# Altium schematic sheet 3-PWR_BAK_BATT.SCHDOC
size A4
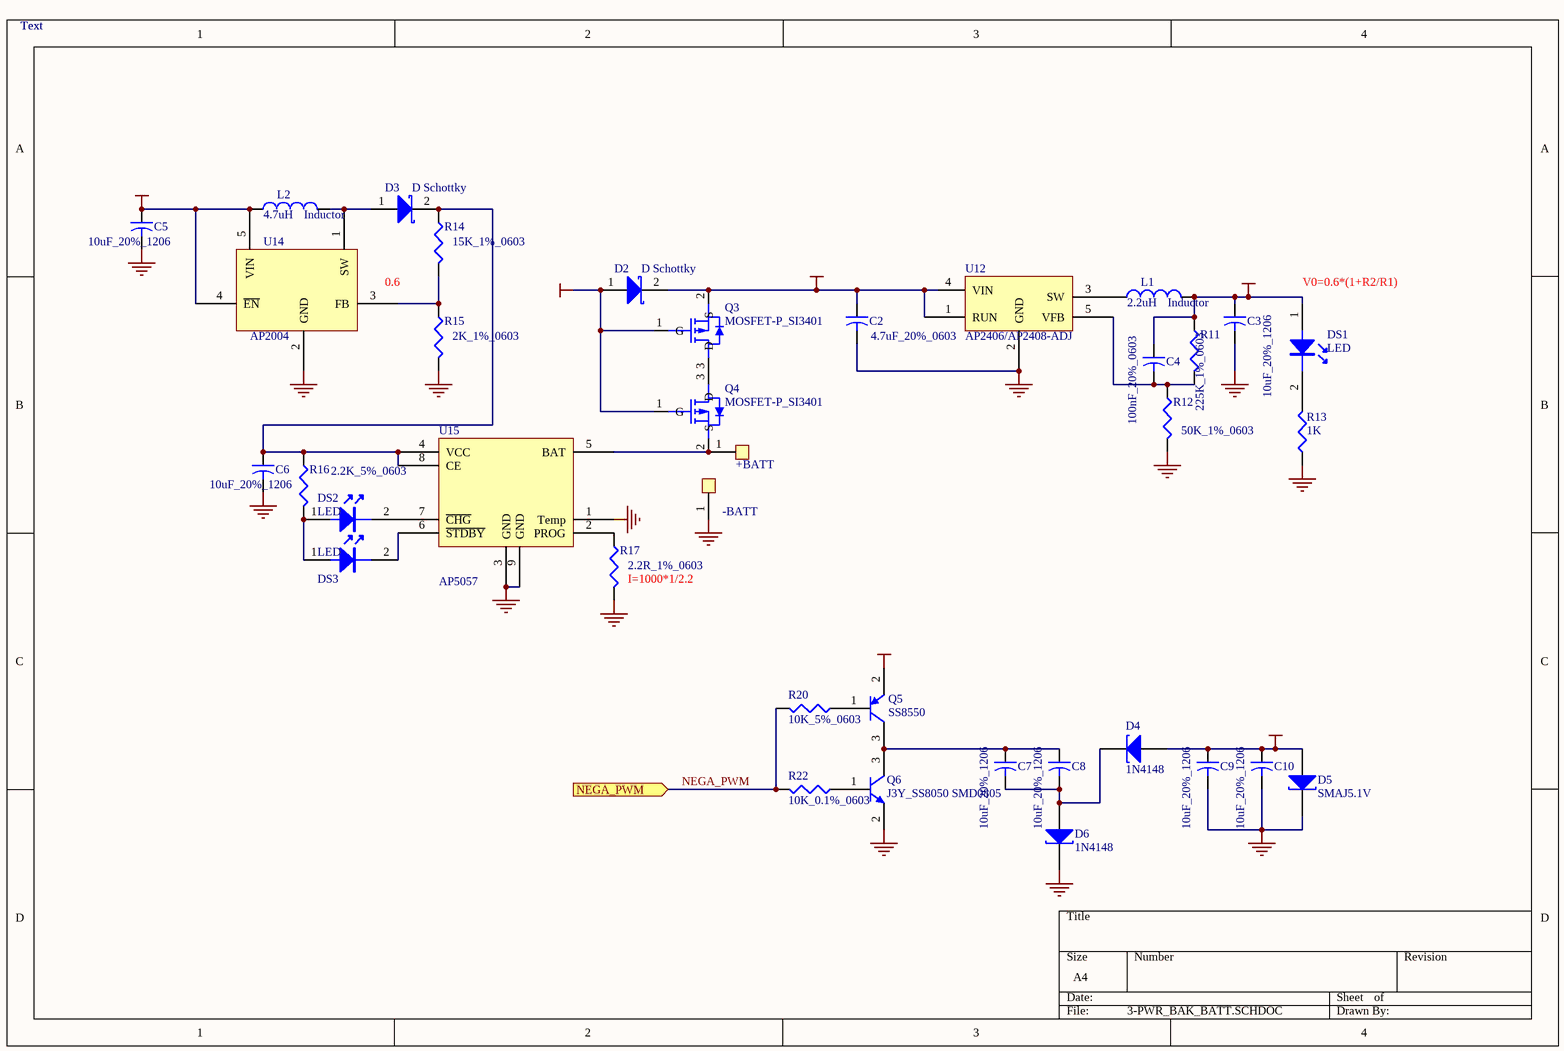
[diagram p0: 3-PWR_BAK_BATT.SCHDOC]

## Parts
+BATT  ND  [END_1.5_2.2]  (value not drawn)
-BATT  ND  [END_1.5_2.2]  (value not drawn)
C2  4.7uF_20%_0603  [C1608-0603]
C3  10uF_20%_1206  [CC3216-1206]
C4  100nF_20%_0603  [C1608-0603]
C5  10uF_20%_1206  [CC3216-1206]
C6  10uF_20%_1206  [CC3216-1206]
C7  10uF_20%_1206  [CC3216-1206]
C8  10uF_20%_1206  [CC3216-1206]
C9  10uF_20%_1206  [CC3216-1206]
C10  10uF_20%_1206  [CC3216-1206]
D2  D Schottky  [DO-214AA_785X100_200X160A100L_P]
D3  D Schottky  [DO-M7]
D4  1N4148  [DSO-F2/D6.1]
D5  SMAJ5.1V  [DSO-F2/D6.1]
D6  1N4148  [DSO-F2/D6.1]
DS1  LED  [LED0805]
DS2  LED  [LED0805]
DS3  LED  [LED0805]
L1  Inductor  value 2.2uH  [L6x6x3_3A]
L2  Inductor  value 4.7uH  [L6x6x3_3A]
Q3  MOSFET-P_SI3401  [SO-G3/C2.5]
Q4  MOSFET-P_SI3401  [SO-G3/C2.5]
Q5  SS8550  [SO-G3/C2.5]
Q6  J3Y_SS8050 SMD0805  [SO-G3/C2.5]
R11  225K_1%_0603  [C1608-0603]
R12  50K_1%_0603  [C1608-0603]
R13  value 1K  [C1608-0603]  (hidden comment: Res3)
R14  15K_1%_0603  [C1608-0603]
R15  2K_1%_0603  [C1608-0603]
R16  2.2K_5%_0603  [C1608-0603]
R17  2.2R_1%_0603  [C1608-0603]
R20  10K_5%_0603  [C1608-0603]
R22  10K_0.1%_0603  [C1608-0603]
U12  AP2406/AP2408-ADJ  [SOT23-5]
U14  AP2004  [SOT23-6]
U15  AP5057  [SON8-6_2-1_27]

## Ports
NEGA_PWM (in)

## Nets
GND: -BATT.1(SW) C2.2 C3.2 C5.2 C6.2 C9.2 C10.2 D5.2(K) D6.2(K) Q6.2(E) R12.2 R13.1 R15.2 R17.2 U12.2(GND) U14.2(GND) U15.1(Temp) U15.3(GND) U15.9(GND)
VCC_3V3: C3.1 C4.1 DS1.1 L1.2 Q5.2(E) R11.1
VCC_-3V3: C9.1 C10.1 D4.1(A) D5.1(A)
VCC_BAT: C5.1 D2.1(A) L2.1 Q3.1(G) Q4.1(G) U14.4(~{EN}) U14.5(VIN)
VCC_CTRL_5V: C2.1 D2.2(K) Q3.2(S) U12.1(RUN) U12.4(VIN)
NEGA_PWM: R20.2 R22.2 ; port NEGA_PWM
Net+BATT_1: +BATT.1(SW) Q4.2(S) U15.5(BAT)
NetC4_2: C4.2 R11.2 R12.1 U12.5(VFB)
NetC6_1: C6.1 D3.2(K) R14.1 R16.1 U15.4(VCC) U15.8(CE)
NetC7_1: C7.1 C8.1 Q5.3(C) Q6.3(C)
NetC7_2: C7.2 C8.2 D4.2(K) D6.1(A)
NetD3_1: D3.1(A) L2.2 U14.1(SW)
NetDS1_2: DS1.2 R13.2
NetDS2_1: DS2.1 DS3.1 R16.2
NetDS2_2: DS2.2 U15.7(~{CHG})
NetDS3_2: DS3.2 U15.6(~{STDBY})
NetL1_1: L1.1 U12.3(SW)
NetQ3_3: Q3.3(D) Q4.3(D)
NetQ5_1: Q5.1(B) R20.1
NetQ6_1: Q6.1(B) R22.1
NetR14_2: R14.2 R15.1 U14.3(FB)
NetR17_1: R17.1 U15.2(PROG)

## Notes on the sheet
- Text
- 0.6
- (near DS1) V0=0.6*(1+R2/R1)
- (near R17) I=1000*1/2.2

## Library data of the parts
C2 C4 = Cap2: Capacitor; Value: 0.1uF; Published: 23-Sep-2002; Publisher: Altium Limited
C3 C5 C6 = Cap2: Capacitor; Value: 10uF; Published: 23-Sep-2002; Publisher: Altium Limited
C7-C10 = Cap2: Capacitor; Value: 0.1uF 20% 0603; Published: 23-Sep-2002; Publisher: Altium Limited
D2 D3 = D Schottky: Schottky Diode; Code - JEDEC: DO-214-AA; Published: 8-Jun-2000; Revision: July-2002: Re-released for DXP Platform.; Publisher: Altium Limited
D4-D6 = D Tunnel1: Tunnel Diode - RLC Model; Published: 8-Jun-2000; LatestRevisionDate: 17-Jul-2002; LatestRevisionNote: Re-released for DXP Platform.; Publisher: Altium Limited
Q3 Q4 = MOSFET-P
Q5 = 2N3906: PNP General Purpose Amplifier; Published: 8-Jun-2000; LatestRevisionDate: 15-Jan-2003; LatestRevisionNote: PCB Footprint 'BCY-W3/D4.7' replaced; DatasheetDocument: 1997; PackageReference: TO-92A; Publisher: Altium Limited; Code_JEDEC: TO-92A
Q6 = QNPN: NPN Bipolar Transistor; Code - JEDEC: SOT-23; Published: 8-Jun-2000; Revision: July-2002: Re-released for DXP Platform.; Publisher: Altium Limited
R11 R12 R14-R17 = Res3: Resistor; Value: 1K%5 0603; Published: 8-Jun-2000; Revision: July-2002: Re-released for DXP Platform.; Publisher: Altium Limited
R13 = Res3: Resistor; Published: 8-Jun-2000; Revision: July-2002: Re-released for DXP Platform.; Publisher: Altium Limited
R20 R22 = Res3: Resistor; Value: 150R %5 0603; Published: 8-Jun-2000; Revision: July-2002: Re-released for DXP Platform.; Publisher: Altium Limited
U12 = AP2406
L1 L2 = Inductor: Published: 8-Jun-2000; Revision: July-2002: Re-released for DXP Platform.; Publisher: Altium Limited